# EAGLE design upanel (EAGLE 5.06)
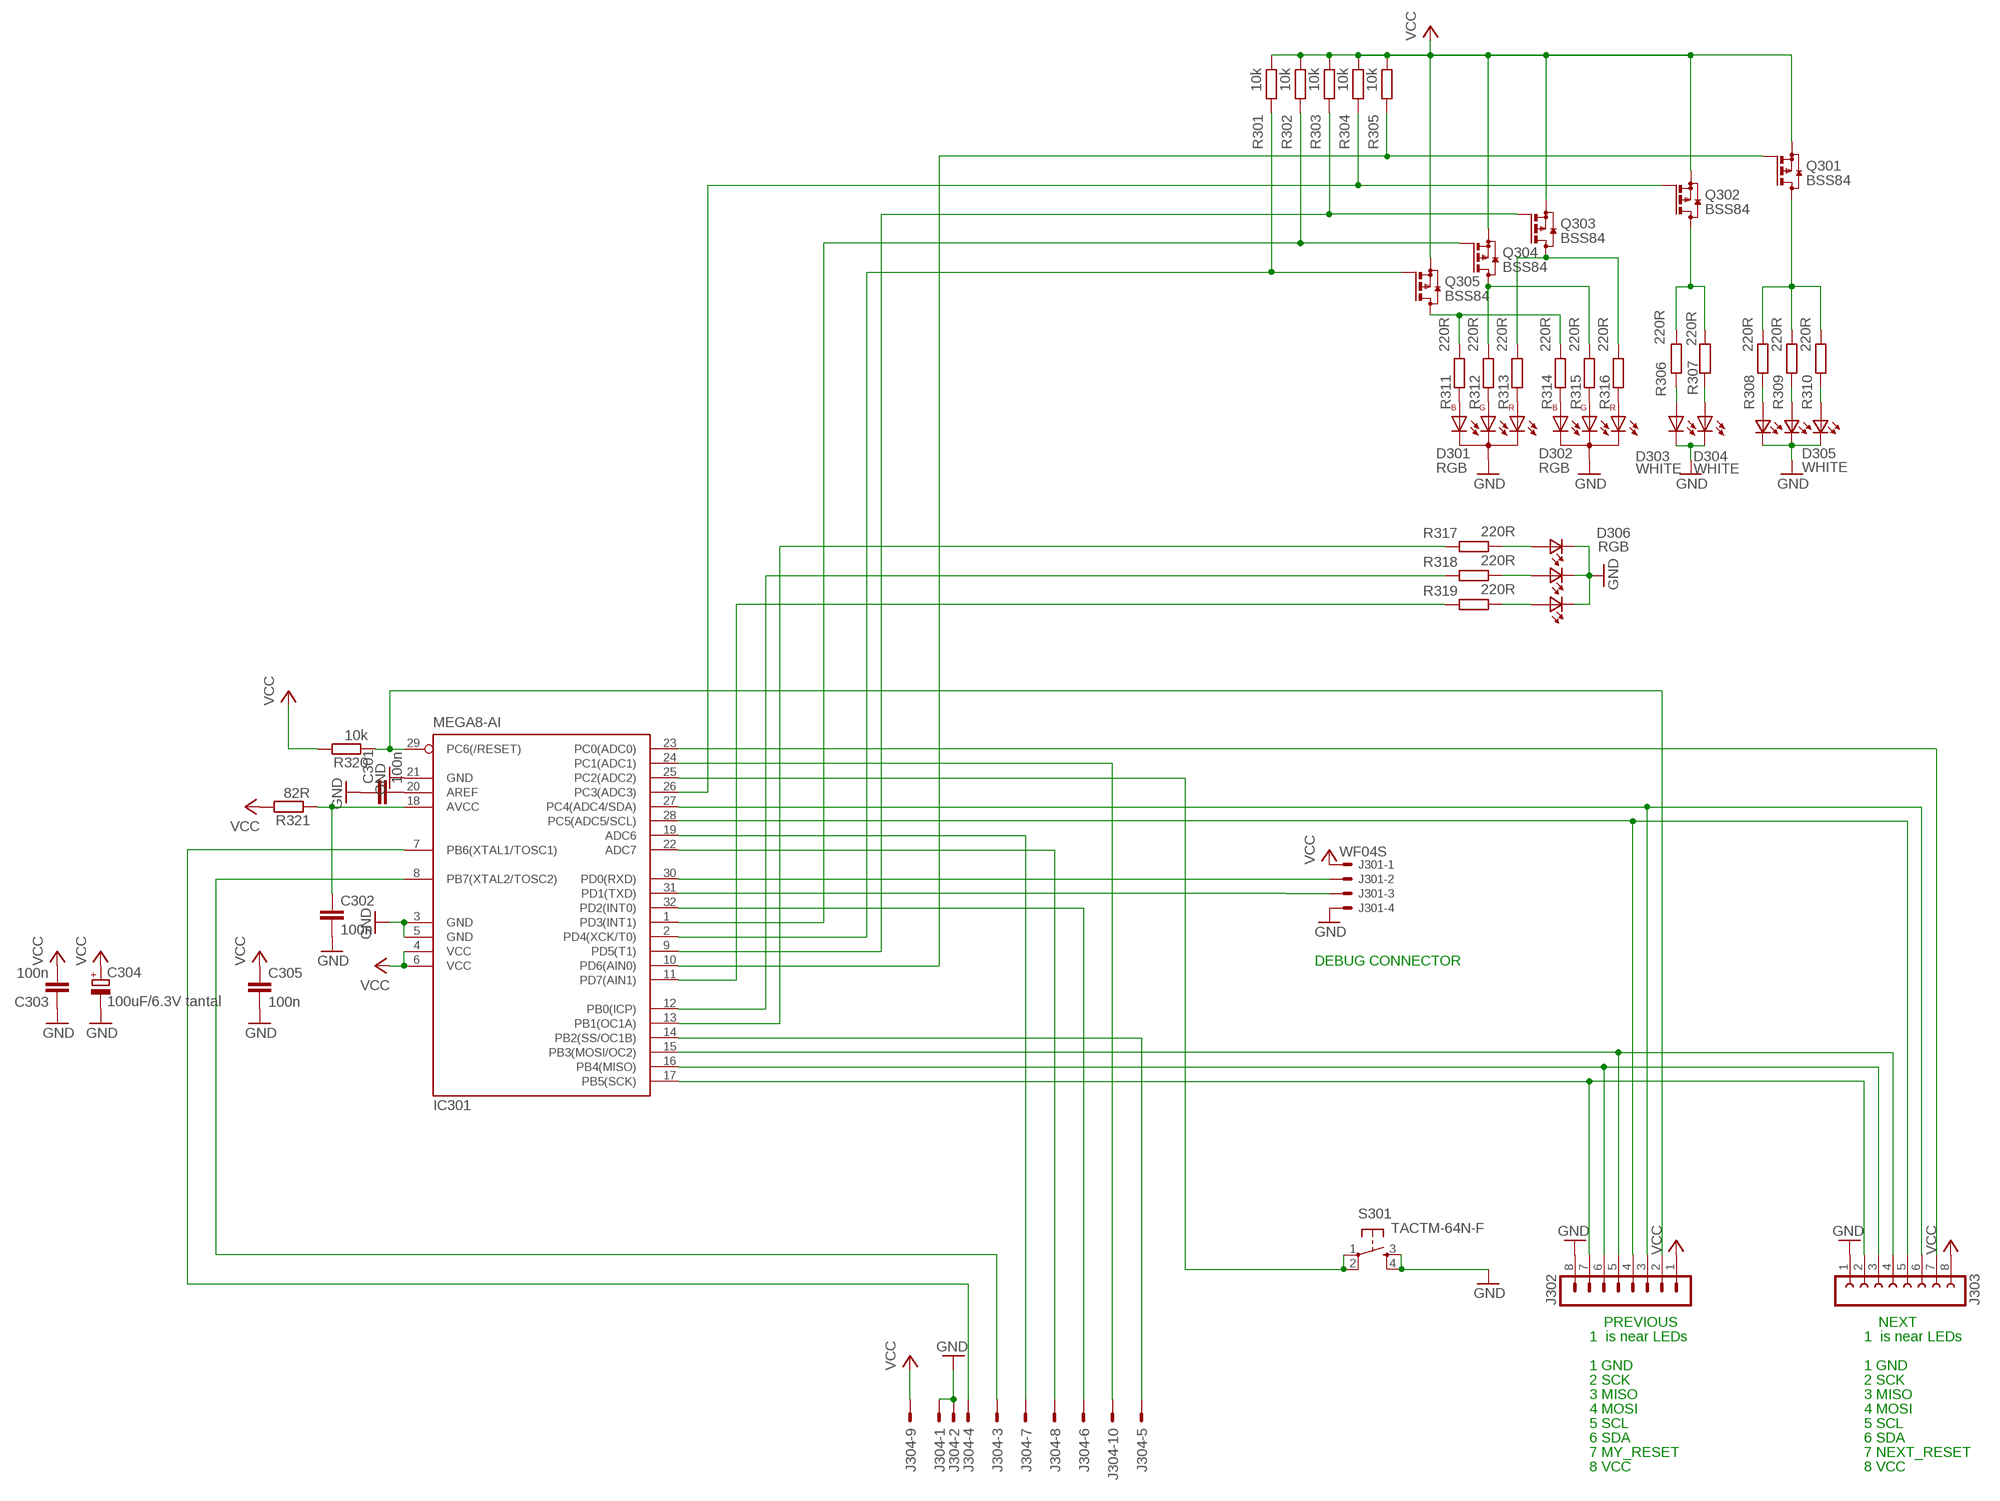
[diagram p0: schematic, sheet 1]

## Parts
C301  100n  CAP  [0805]
C302  100n  CAP  [0805]
C303  100n  CAP  [0805]
C304  100uF/6.3V tantal  CPOL-EUSMCB  [SMC_B]
C305  100n  CAP  [0805]
D301  RGB  LED-RGB-CC  [LED-5-RGB]
D302  RGB  LED-RGB-CC  [LED-5-RGB]
D303  WHITE  LED5MM  [LED5MM]
D304  WHITE  LED5MM  [LED5MM]
D305  WHITE  TOPLED-3  [P-LCC-4-3]
D306  RGB  TOPLED-3  [P-LCC-4-3]
IC301  MEGA8-AI  [TQFP32-08]
J301  WF04S  22-27-2041-04  [6410-04]
J302  MA08-1W  [MA08-1W]
J303  FE08W  [FE08W]
J304  ML10E  [ML10]
Q301  BSS84  [SOT23]
Q302  BSS84  [SOT23]
Q303  BSS84  [SOT23]
Q304  BSS84  [SOT23]
Q305  BSS84  [SOT23]
R301  10k  RES0805  [0805]
R302  10k  RES0805  [0805]
R303  10k  RES0805  [0805]
R304  10k  RES0805  [0805]
R305  10k  RES0805  [0805]
R306  220R  RES0805  [0805]
R307  220R  RES0805  [0805]
R308  220R  RES0805  [0805]
R309  220R  RES0805  [0805]
R310  220R  RES0805  [0805]
R311  220R  RES0805  [0805]
R312  220R  RES0805  [0805]
R313  220R  RES0805  [0805]
R314  220R  RES0805  [0805]
R315  220R  RES0805  [0805]
R316  220R  RES0805  [0805]
R317  220R  R-EU_R0805  [R0805]
R318  220R  R-EU_R0805  [R0805]
R319  220R  R-EU_R0805  [R0805]
R320  10k  RES0805  [0805]
R321  82R  RES0805  [0805]
S301  TACTM-64N-F  DTSM-6  [DTSM-6]

## Nets
GND: C301.1 C302.2 C303.1 C304.- C305.2 D301.2(C) D302.2(C) D303.K(C) D304.K(C) D305.1(C3) D305.2(C2) D305.3(C1) D306.1(C3) D306.2(C2) D306.3(C1) IC301.3(GND) IC301.5(GND) IC301.21(GND) J301.4 J302.8 J303.1 J304.1 J304.2 S301.3 S301.4
MISO: IC301.16(PB4(MISO)) J302.6 J303.3
MOSI: IC301.15(PB3(MOSI/OC2)) J302.5 J303.4
N$1: D303.A R306.1
N$2: D305.6(A3) R308.1
N$3: Q303.3(D) R313.2 R316.2
N$4: D305.4(A1) R310.1
N$5: Q302.3(D) R306.2 R307.2
N$6: D306.4(A1) R319.2
N$7: D306.5(A2) R318.2
N$8: D306.6(A3) R317.2
N$9: IC301.13(PB1(OC1A)) R317.1
N$10: IC301.29(PC6(/RESET)) J302.2 R320.1
N$11: IC301.8(PB7(XTAL2/TOSC2)) J304.3
N$12: IC301.26(PC3(ADC3)) Q302.1(G) R304.1
N$13: IC301.9(PD5(T1)) Q303.1(G) R303.1
N$14: IC301.1(PD3(INT1)) Q304.1(G) R302.1
N$15: D304.A R307.1
N$16: D305.5(A2) R309.1
N$17: IC301.11(PD7(AIN1)) R319.1
N$18: IC301.2(PD4(XCK/T0)) Q305.1(G) R301.1
N$19: IC301.25(PC2(ADC2)) S301.1 S301.2
N$20: IC301.12(PB0(ICP)) R318.1
N$21: IC301.10(PD6(AIN0)) Q301.1(G) R305.1
N$22: Q301.3(D) R308.2 R309.2 R310.2
N$23: D302.3(BA) R314.1
N$25: IC301.7(PB6(XTAL1/TOSC1)) J304.4
N$26: IC301.23(PC0(ADC0)) J303.7
N$31: IC301.31(PD1(TXD)) J301.3
N$32: C301.2 IC301.20(AREF)
N$33: C302.1 IC301.18(AVCC) R321.1
N$36: IC301.19(ADC6) J304.7
N$37: IC301.22(ADC7) J304.8
N$39: IC301.30(PD0(RXD)) J301.2
N$40: IC301.24(PC1(ADC1)) J304.10
N$41: IC301.32(PD2(INT0)) J304.6
N$43: IC301.14(PB2(SS/OC1B)) J304.5
N$47: D302.4(GA) R315.1
N$49: Q305.3(D) R311.2 R314.2
N$50: D302.1(RA) R316.1
N$52: Q304.3(D) R312.2 R315.2
N$56: D301.3(BA) R311.1
N$57: D301.4(GA) R312.1
N$58: D301.1(RA) R313.1
SCK: IC301.17(PB5(SCK)) J302.7 J303.2
SCL: IC301.28(PC5(ADC5/SCL)) J302.4 J303.5
SDA: IC301.27(PC4(ADC4/SDA)) J302.3 J303.6
VCC: C303.2 C304.+ C305.1 IC301.4(VCC) IC301.6(VCC) J301.1 J302.1 J303.8 J304.9 Q301.2(S) Q302.2(S) Q303.2(S) Q304.2(S) Q305.2(S) R301.2 R302.2 R303.2 R304.2 R305.2 R320.2 R321.2

## Notes on the sheet
- DEBUG CONNECTOR
- PREVIOUS | NEXT
- 1  is near LEDs | 1  is near LEDs
- 1 GND | 1 GND
- 2 SCK | 2 SCK
- 3 MISO | 3 MISO
- 4 MOSI | 4 MOSI
- 5 SCL | 5 SCL
- 6 SDA | 6 SDA
- 7 MY_RESET | 7 NEXT_RESET
- 8 VCC | 8 VCC

## Library data of the parts
C301-C303 C305 = barobot:CAP
C304 = rcl:CPOL-EU: POLARIZED CAPACITOR, European symbol
D301 D302 = barobot:LED-RGB-CC: RGB LED 3 colors (red/green/blue), 5 mm, round, common Cathode
D303 D304 = led:LED: LED OSRAM: - CHIPLED LG R971, LG N971, LY N971, LG Q971, LY Q971, LO R971, LY R971 LH N974, LH R974 LS Q976, LO Q976, LY Q976 LO Q996 - Hyper CHIPLED LW Q18S LB Q993, LB Q99A, LB R99A - SideLED LS A670, LO A670, LY A670, LG A670, LP A670 LB A673, LV A673, LT A673, LW A673 LH A674 LY A675 LS A676, LA A676, LO A676, LY A676, LW A676 LS A679, LY A679, LG A679 - Hyper Micro SIDELED® LS Y876, LA Y876, LO Y876, LY Y876 LT Y87S - SmartLED LW L88C, LW L88S LB L89C, LB L89S, LG L890 LS L89K, LO L89K, LY L89K LS L896, LA L896, LO L896, LY L896 - TOPLED LS T670, LO T670, LY T670, LG T670, LP T670 LSG T670, LSP T670, LSY T670, LOP T670, LYG T670 LG T671, LOG T671, LSG T671 LB T673, LV T673, LT T673, LW T673 LH T674 LS T676, LA T676, LO T676, LY T676, LB T676, LH T676, LSB T676, LW T676 LB T67C, LV T67C, LT T67C, LS T67K, LO T67K, LY T67K, LW E67C LS E67B, LA E67B, LO E67B, LY E67B, LB E67C, LV E67C, LT E67C LW T67C LS T679, LY T679, LG T679 LS T770, LO T770, LY T770, LG T770, LP T770 LB T773, LV T773, LT T773, LW T773 LH T774 LS E675, LA E675, LY E675, LS T675 LS T776, LA T776, LO T776, LY T776, LB T776 LHGB T686 LT T68C, LB T68C - Hyper Mini TOPLED® LB M676 - Mini TOPLED Santana® LG M470 LS M47K, LO M47K, LY M47K Source: http://www.osram.convergy.de LUXEON: - LUMILED® LXK2-PW12-R00, LXK2-PW12-S00, LXK2-PW14-U00, LXK2-PW14-V00 LXK2-PM12-R00, LXK2-PM12-S00, LXK2-PM14-U00 LXK2-PE12-Q00, LXK2-PE12-R00, LXK2-PE12-S00, LXK2-PE14-T00, LXK2-PE14-U00 LXK2-PB12-K00, LXK2-PB12-L00, LXK2-PB12-M00, LXK2-PB14-N00, LXK2-PB14-P00, LXK2-PB14-Q00 LXK2-PR12-L00, LXK2-PR12-M00, LXK2-PR14-Q00, LXK2-PR14-R00 LXK2-PD12-Q00, LXK2-PD12-R00, LXK2-PD12-S00 LXK2-PH12-R00, LXK2-PH12-S00 LXK2-PL12-P00, LXK2-PL12-Q00, LXK2-PL12-R00 Source: www.luxeon.com KINGBRIGHT: KA-3528ASYC Source: www.kingbright.com
D305 D306 = led3:TOPLED-3: OSRAM - Hyper Multi TOPLED® (RGB) LB E673, LV E673, LT E673 - Power TOPLED® Enhanced optical Power LED (HOP2000) LS E67B, LA E67B, LO E67B, LY E67B - Hyper Multi TOPLED® Enhanced optical Power LED (HOP2000 / ATON®) LATB T66B - Hyper Multi TOPLED® Hyper-Bright LED LATB T686 Source: http://www.osram.convergy.de/
IC301 = atmel:MEGA8: MICROCONTROLLER 8 Kbytes FLASH, 1 kbytes SRAM, 512 bytes EEPROM, USART, 6-channel 10 bit ADC, 2-channel 8 bit ADC Pin compatible with Atmega48, ATMega88, ATMega168 Source: avr.lbr
J301 = con-molex:22-?-04: CONNECTOR wire to board 2.54 mm (.1 inch) pitch header
J302 = con-lstb:MA08-1W: PIN HEADER
J303 = con-lsta:FE08W: FEMALE HEADER
J304 = con-ml:ML10E: HARTING
Q301-Q305 = transistor-small-signal:BSS84: P-CHANNEL MOS FET
R301-R316 R320 R321 = barobot:RES
R317-R319 = resistor:R-EU_: RESISTOR, European symbol
S301 = switch-tact:DTSM-6

## Board
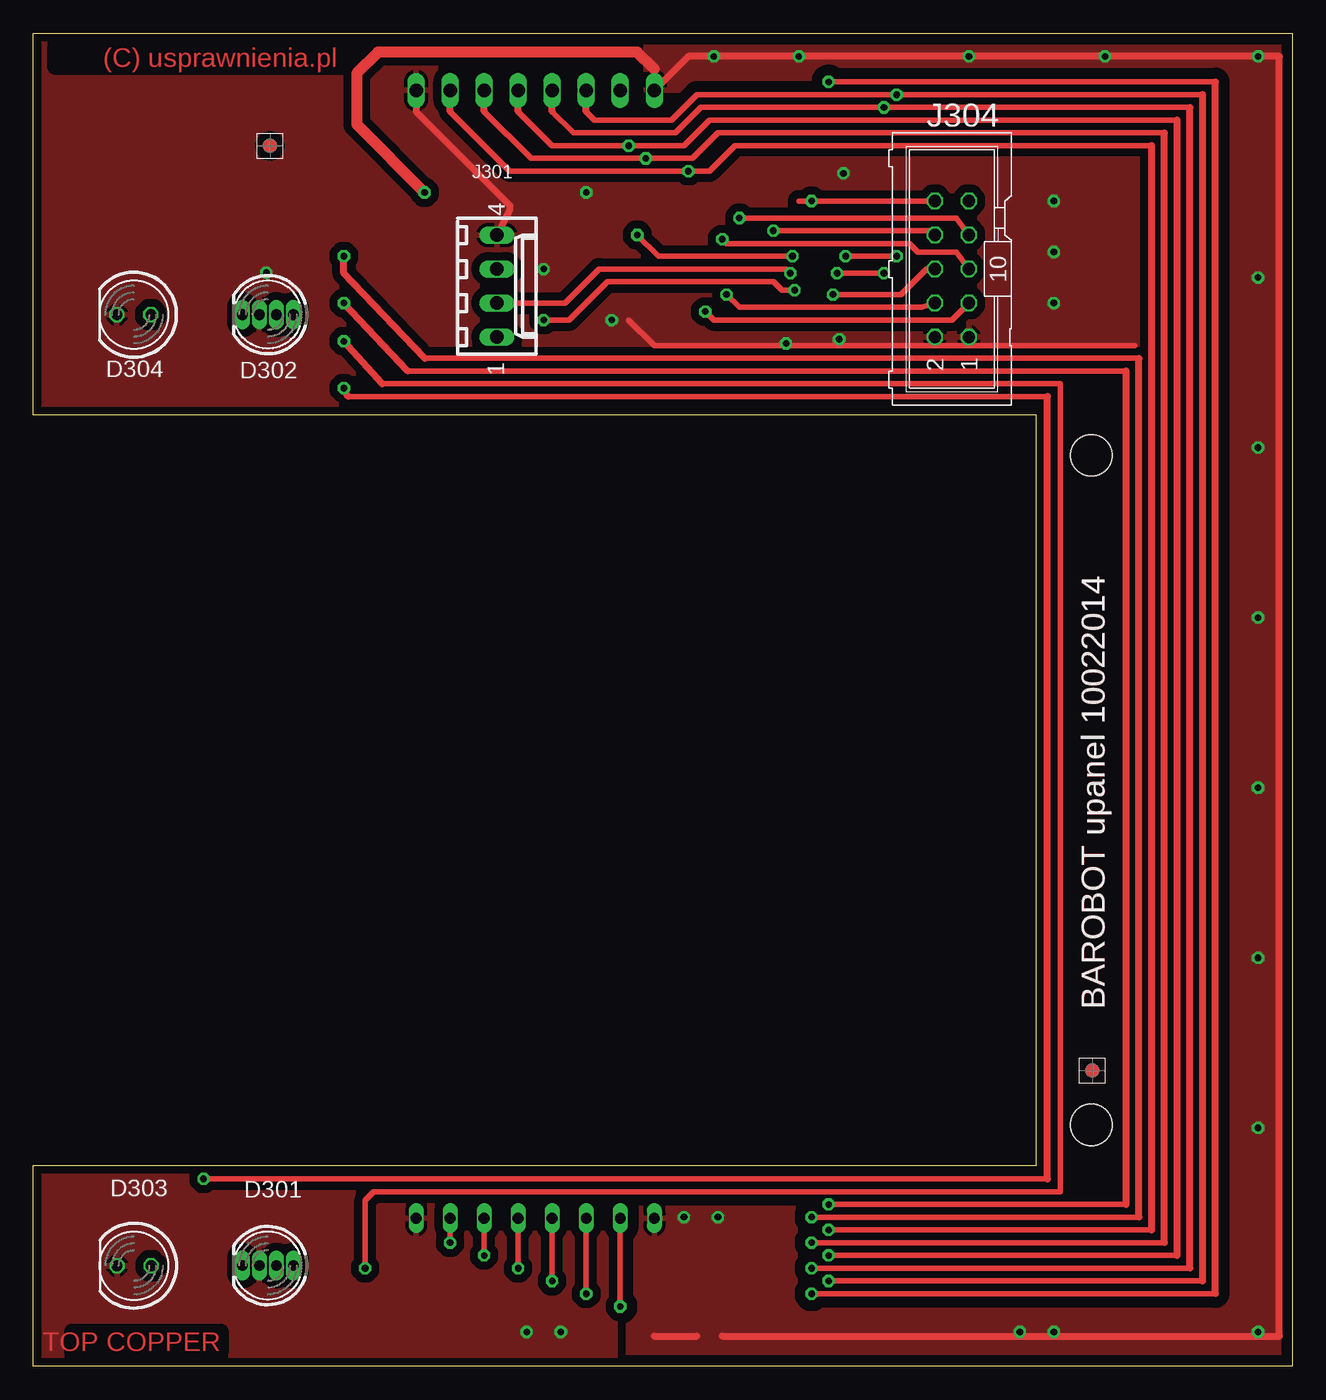
[diagram p1: board, top side]
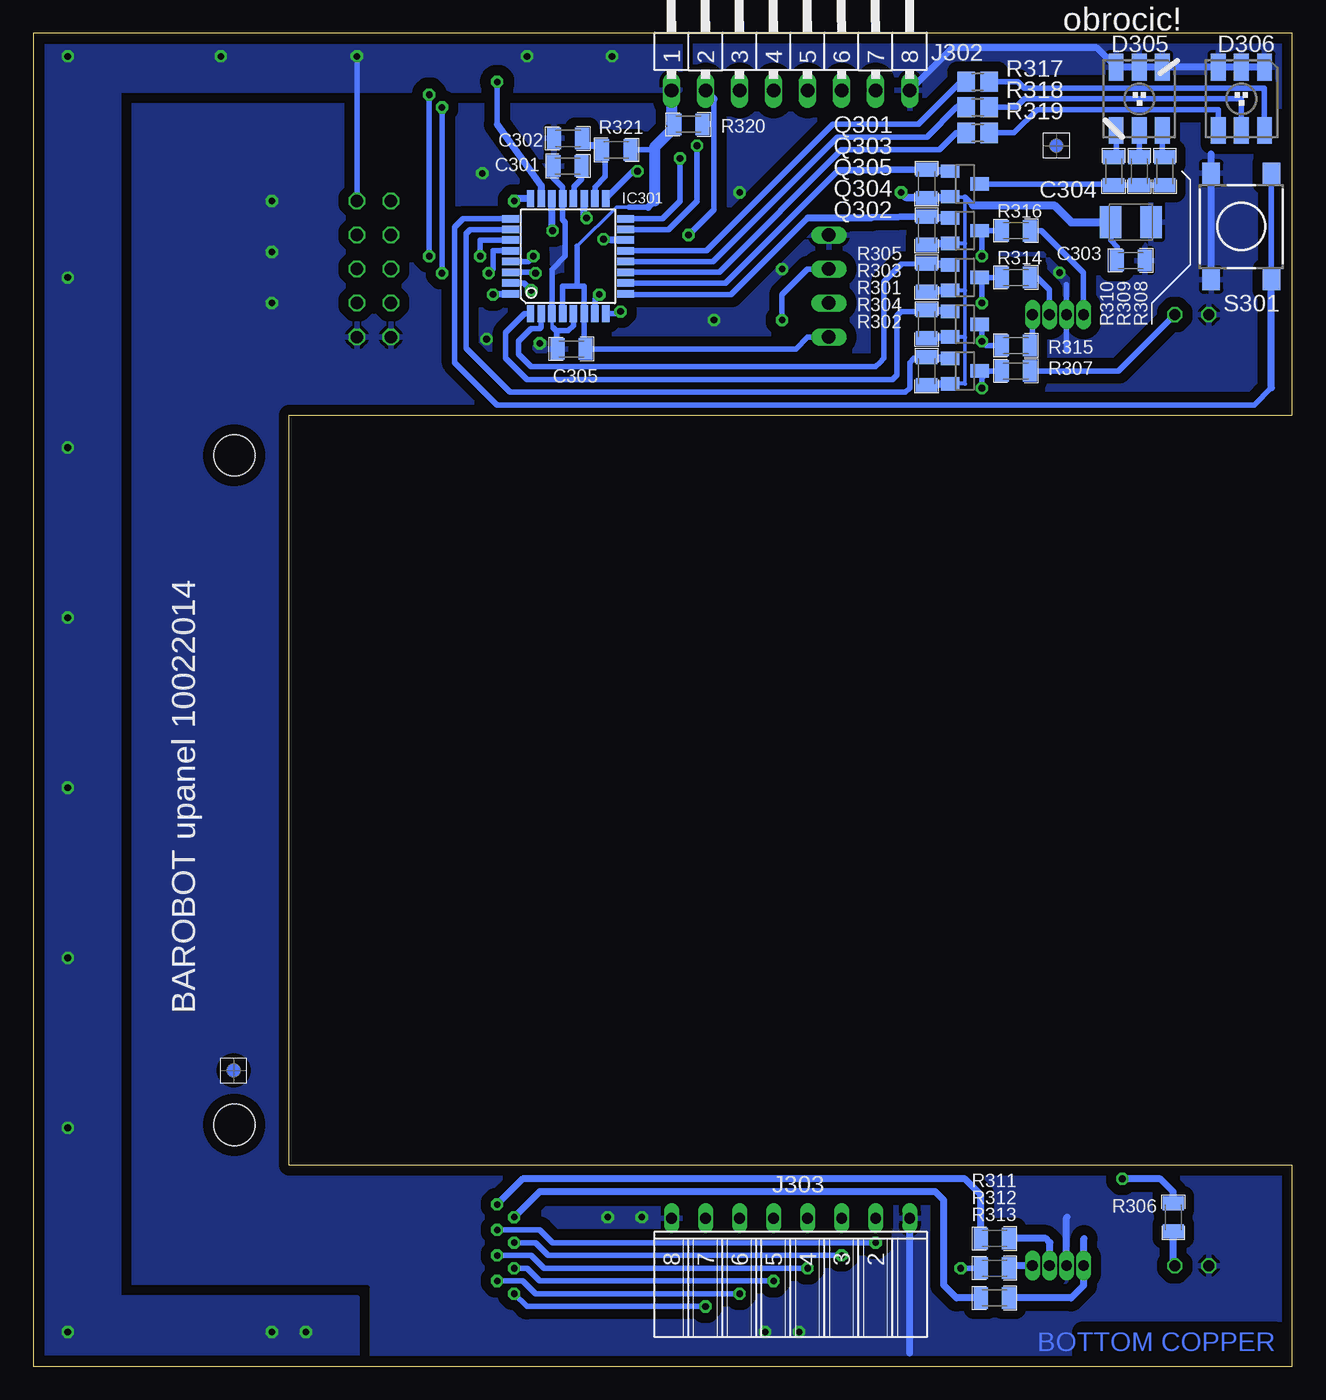
[diagram p2: board, bottom side, seen from below]

Size 94 x 99.5 mm. Coordinates in mm from the lower left corner, seen from the top.
Outline: 0,99.5 94,99.5 94,0 0,0 0,15 74.9,15 74.9,71 0,71 0,99.5
Copper layers (1*16): Top 0.035mm / dielectric 1.5mm / Bottom 0.035mm
Design rules "default *": minimum track width 10mil, minimum drill 0.5mm, track to track 10mil, track to pad 10mil, pad to pad 8mil, via to via 8mil, smd to smd 8mil, copper to edge 20mil, drill to drill 8mil, minimum pad ring 6mil, minimum via ring 8mil, stop-mask expansion 2mil, vias tented up to drill 0mil, thermal gap 10mil
Holes 3.1 mm at 79,18 79,68
bRestrict: area 11.7,84.1 to 12.4,87

### Footprints (pad centres in the part's own frame; a part is rotated, then mirrored left to right if it is on the bottom)
0805 = smd 1.044 x 1.6: 1 -1.048,0; 2 1.048,0
SMC_B = smd 1.6 x 2.4: + -1.5,0; - 1.5,0
LED-5-RGB = drill 0.8 pad 1.016 long: 1 1.905,0; 2 0.635,0; 3 -0.635,0; 4 -1.905,0
LED5MM = drill 0.813 octagon: A -1.27,0; K 1.27,0
P-LCC-4-3 = smd 1.1 x 2: 1 -1.727,-2.362; 2 0,-2.362; 3 1.727,-2.362; 4 1.727,2.362; 5 0,2.362; 6 -1.727,2.362
TQFP32-08 = smd 1.27 x 0.559: 1 -4.293,2.8; 2 -4.293,2; 3 -4.293,1.2; 4 -4.293,0.4; 5 -4.293,-0.4; 6 -4.293,-1.2; 7 -4.293,-2; 8 -4.293,-2.8; 17 4.293,-2.8; 18 4.293,-2; 19 4.293,-1.2; 20 4.293,-0.4; 21 4.293,0.4; 22 4.293,1.2; 23 4.293,2; 24 4.293,2.8 | smd 0.559 x 1.27: 9 -2.8,-4.293; 10 -2,-4.293; 11 -1.2,-4.293; 12 -0.4,-4.293; 13 0.4,-4.293; 14 1.2,-4.293; 15 2,-4.293; 16 2.8,-4.293; 25 2.8,4.293; 26 2,4.293; 27 1.2,4.293; 28 0.4,4.293; 29 -0.4,4.293; 30 -1.2,4.293; 31 -2,4.293; 32 -2.8,4.293
6410-04 = drill 1.016 long: 1 3.81,0; 2 1.27,0; 3 -1.27,0; 4 -3.81,0
MA08-1W = drill 1.016 long: 1 -8.89,0; 2 -6.35,0; 3 -3.81,0; 4 -1.27,0; 5 1.27,0; 6 3.81,0; 7 6.35,0; 8 8.89,0
FE08W = drill 0.813 long: 1 -8.89,0; 2 -6.35,0; 3 -3.81,0; 4 -1.27,0; 5 1.27,0; 6 3.81,0; 7 6.35,0; 8 8.89,0
ML10 = drill 0.914 octagon: 1 -5.08,-1.27; 2 -5.08,1.27; 3 -2.54,-1.27; 4 -2.54,1.27; 5 0,-1.27; 6 0,1.27; 7 2.54,-1.27; 8 2.54,1.27; 9 5.08,-1.27; 10 5.08,1.27
SOT23 = smd 1 x 1.4: 1 -0.95,-1.1; 2 0.95,-1.1; 3 0,1.1
R0805 = smd 1.3 x 1.5: 1 -0.85,0; 2 0.85,0
DTSM-6 = smd 1.55 x 1.3: 1 -3.975,2.25; 2 3.975,2.25; 3 -3.975,-2.25; 4 3.975,-2.25

### Placement (x,y rotation side)
C301  54.11,89.6 0 bottom
C302  54.08,91.66 180 bottom
C303  12.06,82.55 180 bottom
C304  12.06,85.41 0 bottom
C305  53.82,75.95 180 bottom
D301  17.5,7.5 180 top
D302  17.5,78.51 180 top
D303  7.51,7.49 180 top
D304  7.5,78.5 180 top
D305  11.43,94.62 180 bottom
D306  3.81,94.62 180 bottom
IC301  54.08,82.87 90 bottom
J301  34.61,80.65 270 top
J302  37.46,95.25 0 bottom
J303  37.46,11.04 180 bottom
J304  68.58,81.92 90 top
Q301  24.45,88.27 270 bottom
Q302  24.45,74.3 270 bottom
Q303  24.45,84.77 270 bottom
Q304  24.45,77.79 270 bottom
Q305  24.45,81.28 270 bottom
R301  27.3,81.28 270 bottom
R302  27.3,77.79 270 bottom
R303  27.3,84.77 270 bottom
R304  27.3,74.3 270 bottom
R305  27.3,88.27 270 bottom
R306  8.89,11.11 90 bottom
R307  20.64,74.3 180 bottom
R308  9.52,89.22 270 bottom
R309  11.43,89.22 270 bottom
R310  13.33,89.22 270 bottom
R311  22.22,9.53 180 bottom
R312  22.22,7.3 180 bottom
R313  22.22,5.08 180 bottom
R314  20.64,81.28 180 bottom
R315  20.64,76.2 180 bottom
R316  20.64,84.77 180 bottom
R317  23.49,95.89 0 bottom
R318  23.49,93.98 0 bottom
R319  23.49,92.08 0 bottom
R320  45.08,92.71 180 bottom
R321  50.48,90.81 0 bottom
S301  3.81,85.09 270 bottom
U$1  [FIDUCIAL_G10S]  17.66,91.11 0 top
U$2  [FIDUCIAL_G10S]  17.62,91.12 0 bottom
U$3  [FIDUCIAL_G10S]  79.06,22.07 0 bottom
U$4  [FIDUCIAL_G10S]  79.06,22.07 0 top

### Tracks (layer width: path | path; a pad name or v marks a point on that pad's centre or on a via)
GND  (via drill 0.5)
  Top 0.406: 82.23,76.2 46.35,76.2 44.45,78.11
  Top 0.508: J302.8 28.57,93.66 35.56,86.68 35.56,86.36 J301.4
  Bottom 0.254: IC301.3 55.28,77.6 55.21,77.52
  Bottom 0.406: IC301.5 53.68,77.69 54.08,77.29 54.93,77.29 | 54.93,77.29 54.98,77.29 55.21,77.52 | 55.21,89.48 55.21,88.74 54.48,88.02 IC301.21 54.48,85.6 54.29,85.41 54.29,82.87 55.28,81.88 IC301.3 | 16.87,78.11 16.87,75.88 16.83,75.88 | 16.87,78.11 D302.2 | C305.2 54.93,76.01 54.93,77.29 | 16.87,78.11 16.87,80.73
  Bottom 0.508: S301.4 S301.3 6.06,90.49 | D306.1 D306.2 D306.3 D305.1 D305.2 D305.3 14.6,98.43 25.4,98.43 J302.8 | 28.57,0.95 J303.1 | D301.2 16.87,11.07 16.83,11.11 | C302.2 55.12,91.67 55.1,91.68 55.08,91.68 55.11,91.66 55.11,91.64 55.01,91.74 55,91.74
  other vias: 38.1,81.92 56.2,76.36 43.18,78.11 76.2,79.38 76.2,83.19 76.2,87 60.48,89.06 41.27,87.63 60.17,76.68 39.37,2.54 36.83,2.54 17.38,81.64
  pour Bottom (isolate 0.762, rank 3): -1.27,101.6 99.06,101.6 99.06,-2.54 -1.27,-2.54
  pour Top (isolate 0.61, rank 2): 0,99.06 96.52,99.06 96.52,-1.27 0,-1.27
MISO  (via drill 0.5)
  Top 0.406: v58.1,9.21 84.45,9.21 | 84.45,92.08 51.12,92.08 49.21,90.17 v45.72,90.17 37.15,90.17 33.65,93.66 | v33.65,8.26 J303.3
  Top 0.508: 84.45,9.21 84.45,92.08 | 33.65,93.66 J302.6
  Bottom 0.406: IC301.16 47.05,85.67 45.72,87 v45.72,90.17 | v58.1,9.21 56.51,9.21 55.56,8.26 v33.65,8.26
MOSI  (via drill 0.5)
  Top 0.406: v59.37,8.26 85.41,8.26 | 85.41,93.03 50.48,93.03 48.58,91.12 v44.45,91.12 38.73,91.12 36.19,93.66 | v36.19,7.3 J303.4
  Top 0.508: 85.41,8.26 85.41,93.03 | 36.19,93.66 J302.5
  Bottom 0.406: IC301.15 46.58,84.87 44.45,87 v44.45,91.12 | v59.37,8.26 56.83,8.26 55.88,7.3 v36.19,7.3
N$1
  Bottom 0.508: D303.A 8.89,7.61 R306.1
N$2
  Bottom 0.406: D305.6 9.7,90.27 R308.1
N$3  (via drill 0.5)
  Top 0.406: 82.55,75.25 29.21,75.25 | v58.1,11.11 82.55,11.11
  Top 0.508: 82.55,11.11 82.55,75.25 | 29.21,75.25 23.18,81.6 v23.18,82.87
  Bottom 0.406: 22.86,84.77 R316.2 | 22.86,84.77 Q303.3 | v23.18,82.87 23.18,84.46 22.86,84.77
  Bottom 0.508: R313.2 25.08,5.08 26.03,6.03 26.03,12.38 26.67,13.02 56.2,13.02 v58.1,11.11
N$4
  Bottom 0.406: D305.4 13.16,90.27 R310.1
N$5  (via drill 0.5)
  Top 0.406: 75.72,72.39 23.49,72.39 | 75.72,13.97 15.56,13.97 v12.7,13.97
  Top 0.508: 75.72,13.97 75.72,72.39 | 23.49,72.39 v23.18,73.03
  Bottom 0.406: v23.18,73.03 23.18,73.81 | 23.18,73.81 Q302.3 | 23.18,73.81 22.69,74.3 R307.2
  Bottom 0.508: v12.7,13.97 9.84,13.97 8.89,13.02 R306.2
  Bottom 0.61: Q302.3 23.35,74.44
N$6
  Bottom 0.406: D306.4 5.54,93.82 19.05,93.82 20.8,92.08 R319.2
N$7
  Bottom 0.406: D306.5 3.81,94.62 20,94.62 20.64,93.98 21.91,93.98 R318.2
N$8
  Bottom 0.406: D306.6 2.08,95.41 20,95.41 20.48,95.89 R317.2
N$9
  Bottom 0.406: IC301.13 43.73,83.27 34.29,92.71 27.94,92.71 24.76,95.89 R317.1
N$10  (via drill 0.5)
  Top 0.406: v56.67,82.87 46.67,82.87 v45.08,84.46
  Bottom 0.406: 43.18,92.71 43.18,94.62 | v56.67,82.87 57.07,82.47 IC301.29 | 43.18,92.71 R320.1 | v45.08,84.46 43.18,86.36 43.18,92.71
  Bottom 0.508: 43.18,94.62 J302.2
N$11  (via drill 0.5)
  Top 0.406: J304.3 68.9,78.42 68.58,78.11 50.8,78.11 v50.16,78.74
  Bottom 0.406: IC301.8 50.33,78.58 v50.16,78.74
N$12
  Bottom 0.406: 27.33,75.25 28.26,75.25 28.57,74.93 28.57,73.03 28.89,72.71 58.42,72.71 61.7,75.99 61.7,84.55 61.38,84.87 IC301.26
  Bottom 0.508: R304.1 27.33,75.25
  Bottom 0.61: R304.1 25.57,75.27 Q302.1
N$13
  Bottom 0.406: 49.73,80.01 41.91,80.01 36.19,85.73
  Bottom 0.508: 49.73,80.01 IC301.9 | 36.19,85.73 31.43,85.73 31.46,85.75 R303.1
  Bottom 0.61: R303.1 25.57,85.75 Q303.1
N$14
  Bottom 0.406: IC301.1 57.31,78.58 58.1,77.79 58.74,77.15 58.74,75.25 57.15,73.66 56.88,73.66 29.84,73.66 29.53,73.98 29.53,77.5 29.53,78.42 29.21,78.74 27.33,78.74 R302.1
  Bottom 0.61: R302.1 25.57,78.76 Q304.1
N$15
  Bottom 0.406: R307.1 12.98,74.3 D304.A
N$16
  Bottom 0.406: R309.1 D305.5
N$17
  Bottom 0.406: R319.1 25.08,92.08 26.35,90.81 33.65,90.81 42.79,81.67 IC301.11
N$18
  Bottom 0.406: R301.1 29.19,82.26 29.21,82.23 30.48,80.96 30.48,75.25 30.8,74.93 31.11,74.61 56.08,74.61 56.83,74.61 57.78,75.57 57.78,76.52 56.83,77.47 56.2,77.47 56.08,77.58 IC301.2
  Bottom 0.61: R301.1 25.57,82.26 Q305.1
N$19
  Bottom 0.406: 1.56,73.05 2.86,71.76 59.37,71.76 62.55,74.93 62.55,85.03 61.91,85.67 IC301.25 | S301.2 S301.1
  Bottom 0.508: 1.56,73.05 S301.2
N$20
  Bottom 0.406: 25.08,93.98 27.3,91.76 33.97,91.76 43.26,82.47 IC301.12
  Bottom 0.508: R318.1 25.08,93.98
N$21
  Bottom 0.406: IC301.10 42.32,80.87 33.95,89.24
  Bottom 0.508: R305.1 33.95,89.24
  Bottom 0.61: R305.1 25.57,89.24 Q301.1
N$22
  Bottom 0.406: R308.2 R309.2 12.7,88.17 | 12.7,88.17 R310.2 | Q301.3 12.7,88.27 12.7,88.17
N$23
  Bottom 0.406: R314.1 19.05,81.28 18.14,80.37 D302.3
N$25  (via drill 0.5)
  Top 0.406: J304.4 66.36,79.06 60.01,79.06 | 60.01,79.06 60.64,79.06 | 60.01,79.06 52.7,79.06 v51.75,80.01
  Bottom 0.406: IC301.7 52.08,79.68 v51.75,80.01
N$26  (via drill 0.5)
  Top 0.406: 88.26,95.89 v59.37,95.89 | v58.1,5.4 88.26,5.4 | v43.81,4.45 J303.7
  Top 0.508: 88.26,5.4 88.26,95.89
  Bottom 0.406: v59.37,95.89 59.37,92.71 | v58.1,5.4 57.15,4.45 v43.81,4.45
  Bottom 0.508: IC301.23 56.08,88.15 59.37,92.71
N$31  (via drill 0.5)
  Top 0.406: v38.1,78.11 40,78.11 40.32,78.42 42.23,80.33 42.86,80.96 55.24,80.96 55.88,80.33 v56.83,80.33
  Bottom 0.406: v56.83,80.33 57.37,80.87 IC301.31 | v38.1,78.11 38.1,80.01 36.51,81.6 36.19,81.92 J301.3
N$32
  Bottom 0.406: IC301.20 53.63,87.21 53.63,88.07 53.08,88.62 53.08,89.6 C301.2
  Bottom 0.508: C301.2 53.08,89.6
N$33
  Bottom 0.406: IC301.18 52.08,88.04 51.33,88.79 51.33,90.71
  Bottom 0.508: C302.1 | C302.1 53.02,91.66 53.02,91.12 51.53,91.12 R321.1 51.53,90.71 51.33,90.71
N$36  (via drill 0.5)
  Top 0.406: v52.7,85.73 58.1,85.73 58.74,85.73 68.9,85.73 J304.7
  Bottom 0.508: IC301.19 52.88,85.9 v52.7,85.73
N$37  (via drill 0.5)
  Top 0.406: J304.8 66.99,84.77 v55.24,84.77
  Bottom 0.508: IC301.22 55.28,85.37 v55.24,84.77
N$39  (via drill 0.5)
  Top 0.406: 41.59,81.28 39.69,79.38 J301.2 | 41.59,81.28 41.91,81.6 | v56.51,81.6 56.2,81.92 53.34,81.92 42.23,81.92 41.59,81.28
  Bottom 0.406: IC301.30 56.51,81.67 v56.51,81.6
N$40  (via drill 0.5)
  Top 0.406: J304.10 57.15,87 v58.1,87
  Bottom 0.508: IC301.24 57.94,87.16 v58.1,87
N$41  (via drill 0.5)
  Top 0.406: J304.6 66.67,81.92 64.77,80.01 v59.69,80.01
  Bottom 0.508: IC301.32 58.42,80.02 v59.69,80.01
N$43  (via drill 0.5)
  Top 0.406: J304.5 68.9,83.19 66.04,83.19 65.4,83.82 51.75,83.82 v51.43,84.14
  Bottom 0.508: IC301.14 50.87,84.07 v51.43,84.14
N$47
  Bottom 0.406: D302.4 19.41,76.58 19.59,76.58 R315.1
N$49  (via drill 0.5)
  Top 0.406: 81.6,74.3 27.94,74.3 | v59.37,12.07 81.6,12.07
  Top 0.508: 81.6,12.07 81.6,74.3 | 27.94,74.3 v23.18,79.38
  Bottom 0.406: v23.18,79.38 23.18,80.79 Q305.3 R314.2
  Bottom 0.508: R311.2 23.27,12.8 24.45,13.97 57.47,13.97 v59.37,12.07
N$50
  Bottom 0.406: R316.1 18.73,84.77 15.6,81.64 D302.1
N$52  (via drill 0.5)
  Top 0.406: 26.03,73.34 76.68,73.34 76.68,13.02 55.24,13.02 25.4,13.02 24.76,12.38 v24.76,7.3
  Top 0.508: 26.03,73.34 v23.18,76.52
  Bottom 0.406: Q304.3 23.18,77.3 v23.18,76.52 22.86,76.2 R315.2 | R312.2 v24.76,7.3
N$56
  Bottom 0.508: R311.1 18.41,9.53 18.1,9.21 18.1,7.54 D301.3
N$57
  Bottom 0.508: R312.1 20.98,7.5 D301.4
N$58
  Bottom 0.406: 15.56,7.54 15.56,7.5 D301.1
  Bottom 0.508: 15.56,7.54 15.56,9.53 | R313.1 16.51,5.08 15.6,5.99 D301.1
SCK  (via drill 0.5)
  Top 0.406: v59.37,10.16 83.5,10.16 | 83.5,91.12 52.39,91.12 50.48,89.22 v48.89,89.22 35.56,89.22 31.11,93.66 | v31.11,9.21 J303.2
  Top 0.508: 83.5,10.16 83.5,91.12 | 31.11,93.66 J302.7
  Bottom 0.406: IC301.17 49.23,89.22 v48.89,89.22 | v59.37,10.16 56.2,10.16 55.24,9.21 v31.11,9.21
SCL  (via drill 0.5)
  Top 0.406: 86.36,93.98 v63.5,93.98 49.85,93.98 47.94,92.08 40.32,92.08 38.73,93.66 | v63.5,81.6 v60.01,81.6 | v58.1,7.3 86.36,7.3 | v38.73,6.35 J303.5
  Top 0.508: 86.36,7.3 86.36,93.98 | 38.73,93.66 J302.4
  Bottom 0.406: IC301.28 59.69,83.27 59.69,81.92 v60.01,81.6 | v63.5,93.98 v63.5,81.6 | v58.1,7.3 57.15,7.3 56.2,6.35 v38.73,6.35
SDA  (via drill 0.5)
  Top 0.406: 87.31,94.93 v64.45,94.93 49.53,94.93 47.62,93.03 41.91,93.03 41.27,93.66 | v64.45,82.87 v60.64,82.87 | v59.37,6.35 87.31,6.35 | v41.27,5.4 J303.6
  Top 0.508: 87.31,6.35 87.31,94.93 | 41.27,93.66 J302.3
  Bottom 0.406: IC301.27 60.64,84.07 v60.64,82.87 | v64.45,94.93 v64.45,82.87 | v59.37,6.35 57.47,6.35 56.51,5.4 v41.27,5.4
VCC  (via drill 0.5)
  Top 0.406: J302.1 46.35,96.84
  Top 0.508: 46.35,2.22 49.53,2.22 | 51.43,2.22 93.03,2.22 93.03,97.79 v69.85,97.79 48.89,97.79 J302.1
  Top 0.813: v29.21,87.63 24.13,92.71 24.13,96.52 25.72,98.11 45.08,98.11 46.35,96.84
  Bottom 0.254: 25.57,87.29 24.45,87.29 24.45,83.82 | 24.45,76.84 24.45,73.34 | 24.45,80.33 24.45,76.84 | 24.45,83.82 24.45,80.33 | 24.45,76.84 24.45,76.81 | 24.45,80.33 24.45,80.3 | 24.45,83.82 | 53.39,83.61 50.48,86.52 49.53,86.52
  Bottom 0.305: 24.45,73.34 Q302.2 | 24.45,76.81 25.57,76.81 | 24.45,80.3 25.57,80.3 | 24.45,83.82 Q303.2
  Bottom 0.406: Q302.2 | v69.85,97.79 J304.9 | 53.39,83.61 53.39,80.65 | 46.35,92.71 46.35,92.28 | 46.35,92.81 46.35,92.71 | 48.1,86.52 49.53,86.52 | 47.62,90.81 R321.2 | 14.6,85.39 C304.+ 13.56,84.05 13.06,83.55 13.11,83.5 C303.2 | 24.45,87.29 23.84,86.68 | IC301.4 54.48,80.65 53.39,80.65 | 53.39,80.65 52.88,80.65 IC301.6 52.88,75.95 C305.1 37.08,75.95 36.19,76.84 J301.1 | 46.35,92.71 R320.2
  Bottom 0.508: 47.62,87 48.1,86.52 | C303.2 13.07,82.55 | C305.1 52.82,75.95
  Bottom 0.61: R304.2 25.57,73.32 Q302.2 | R302.2 25.57,76.81 Q304.2 | R301.2 25.57,80.3 Q305.2 | R303.2 25.57,83.8 Q303.2 | Q301.2 25.57,87.29 R305.2 28.87,87.29 v29.21,87.63 | C304.+ 16.51,85.41 17.78,86.68 23.84,86.68
  Bottom 0.813: J302.1 46.35,92.81 | 46.35,92.28 47.62,91.01 47.62,90.81 47.62,87
  other vias: 57.15,97.79 80.01,97.79 91.44,97.79 91.44,81.28 91.44,68.58 91.44,55.88 91.44,43.18 91.44,30.48 91.44,17.78 91.44,2.54 73.66,2.54 50.8,97.79 48.58,11.11 51.12,11.11 76.2,2.54
  pour Top (isolate 0.813): 44.45,0 93.98,0 93.98,99.06 45.72,99.06 45.72,95.25 87.63,95.25 87.63,5.08 57.15,5.08 57.15,12.07 44.45,12.07
  pour Bottom (isolate 0.813, rank 2): 69.85,0 93.98,0 93.98,99.06 45.72,99.06 45.72,95.25 87.63,95.25 87.63,5.08 69.85,5.08
  pour Bottom (isolate 0.813, rank 2): 55.88,8.89 55.88,12.7 45.72,12.7 45.72,8.89

### Text on the board
Top: (C) usprawnienia.pl | BAROBOT upanel 10022014 | TOP COPPER
Bottom: BOTTOM COPPER
tNames: BAROBOT upanel 10022014
bNames: obrocic! | BAROBOT upanel 10022014
bDocu: GND | SCK | MIS | MOSI | SCL | SDA | RESET | VCC